# Altium schematic sheet Led_Control.SchDoc
size A
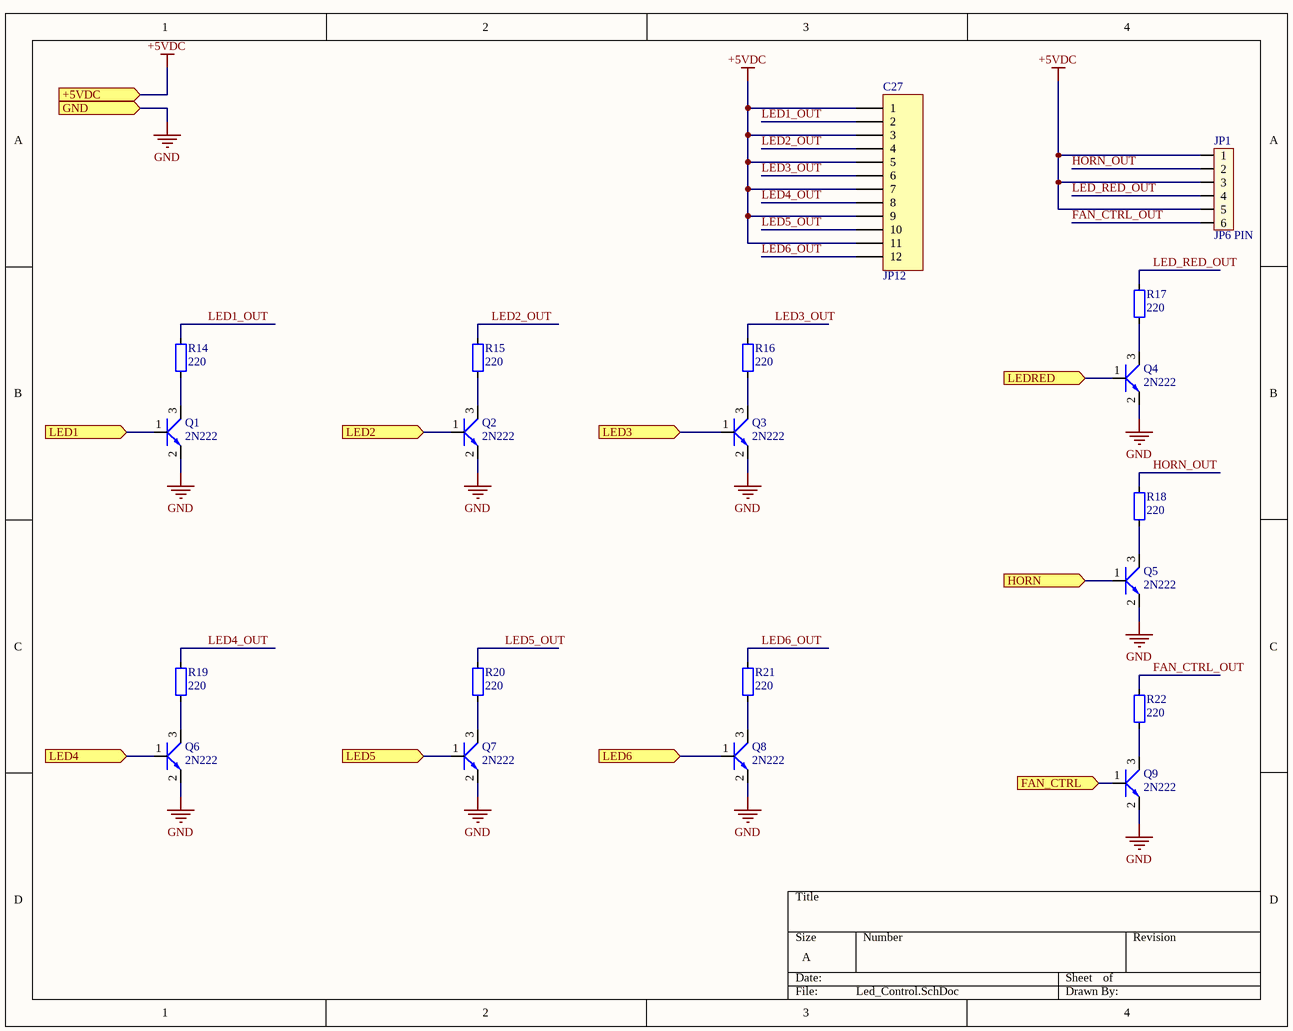
[diagram p0: Led_Control.SchDoc]

## Parts
C27  JP12  [JP12-D1T]
JP1  JP6 PIN  [JP6]
Q1  2N222  [SOT23D]
Q2  2N222  [SOT23D]
Q3  2N222  [SOT23D]
Q4  2N222  [SOT23D]
Q5  2N222  [SOT23D]
Q6  2N222  [SOT23D]
Q7  2N222  [SOT23D]
Q8  2N222  [SOT23D]
Q9  2N222  [SOT23D]
R14  220  [RES-SMD-0805]
R15  220  [RES-SMD-0805]
R16  220  [RES-SMD-0805]
R17  220  [RES-SMD-0805]
R18  220  [RES-SMD-0805]
R19  220  [RES-SMD-0805]
R20  220  [RES-SMD-0805]
R21  220  [RES-SMD-0805]
R22  220  [RES-SMD-0805]

## Ports
+5VDC (in), FAN_CTRL (in), GND (in), HORN (in), LED1 (in), LED2 (in), LED3 (in), LED4 (in), LED5 (in), LED6 (in), LEDRED (in)

## Nets
+5VDC: C27.1 C27.3 C27.5 C27.7 C27.9 C27.11 JP1.1 JP1.3 JP1.5 ; port +5VDC
GND: Q1.2(E) Q2.2(E) Q3.2(E) Q4.2(E) Q5.2(E) Q6.2(E) Q7.2(E) Q8.2(E) Q9.2(E) ; port GND
FAN_CTRL: Q9.1(B) ; port FAN_CTRL
FAN_CTRL_OUT: JP1.6 R22.2
HORN: Q5.1(B) ; port HORN
HORN_OUT: JP1.2 R18.2
LED1: Q1.1(B) ; port LED1
LED1_OUT: C27.2 R14.2
LED2: Q2.1(B) ; port LED2
LED2_OUT: C27.4 R15.2
LED3: Q3.1(B) ; port LED3
LED3_OUT: C27.6 R16.2
LED4: Q6.1(B) ; port LED4
LED4_OUT: C27.8 R19.2
LED5: Q7.1(B) ; port LED5
LED5_OUT: C27.10 R20.2
LED6: Q8.1(B) ; port LED6
LED6_OUT: C27.12 R21.2
LED_RED_OUT: JP1.4 R17.2
LEDRED: Q4.1(B) ; port LEDRED
NetQ1_3: Q1.3(C) R14.1
NetQ2_3: Q2.3(C) R15.1
NetQ3_3: Q3.3(C) R16.1
NetQ4_3: Q4.3(C) R17.1
NetQ5_3: Q5.3(C) R18.1
NetQ6_3: Q6.3(C) R19.1
NetQ7_3: Q7.3(C) R20.1
NetQ8_3: Q8.3(C) R21.1
NetQ9_3: Q9.3(C) R22.1

## Library data of the parts
C27 = JP12: WR-PHD 2.54 mm Angled Socket Header; Manufacturer: W¨¹rth Elektronik eiSos GmbH; partNo: 613012143121; ComponentLink1 Description: Manufacturer; ComponentLink2 Description: Datasheet; NoPins: 12; Created Date: 29 March 2013; ComponentLink1URL: http://www.we-online.com; ComponentLink2URL: http://katalog.we-online.de/em/datasheet/6130xx143121.pdf; Created by: Karrer Zheng
JP1 = JP6: Value: JP7
Q1-Q9 = 2N222: NPN 600mW, ECB; Value: C1815
R14-R22 = Resistor - SMD: Resistor; Manufacturer: Generic Components; Class: Passive; Published: 08/06/2000; Publisher: Altium Hobart Technology Centre